# EAGLE schematic IRIS1304_v3.0 (EAGLE 7.3.0)

## Sheet 1 of 4
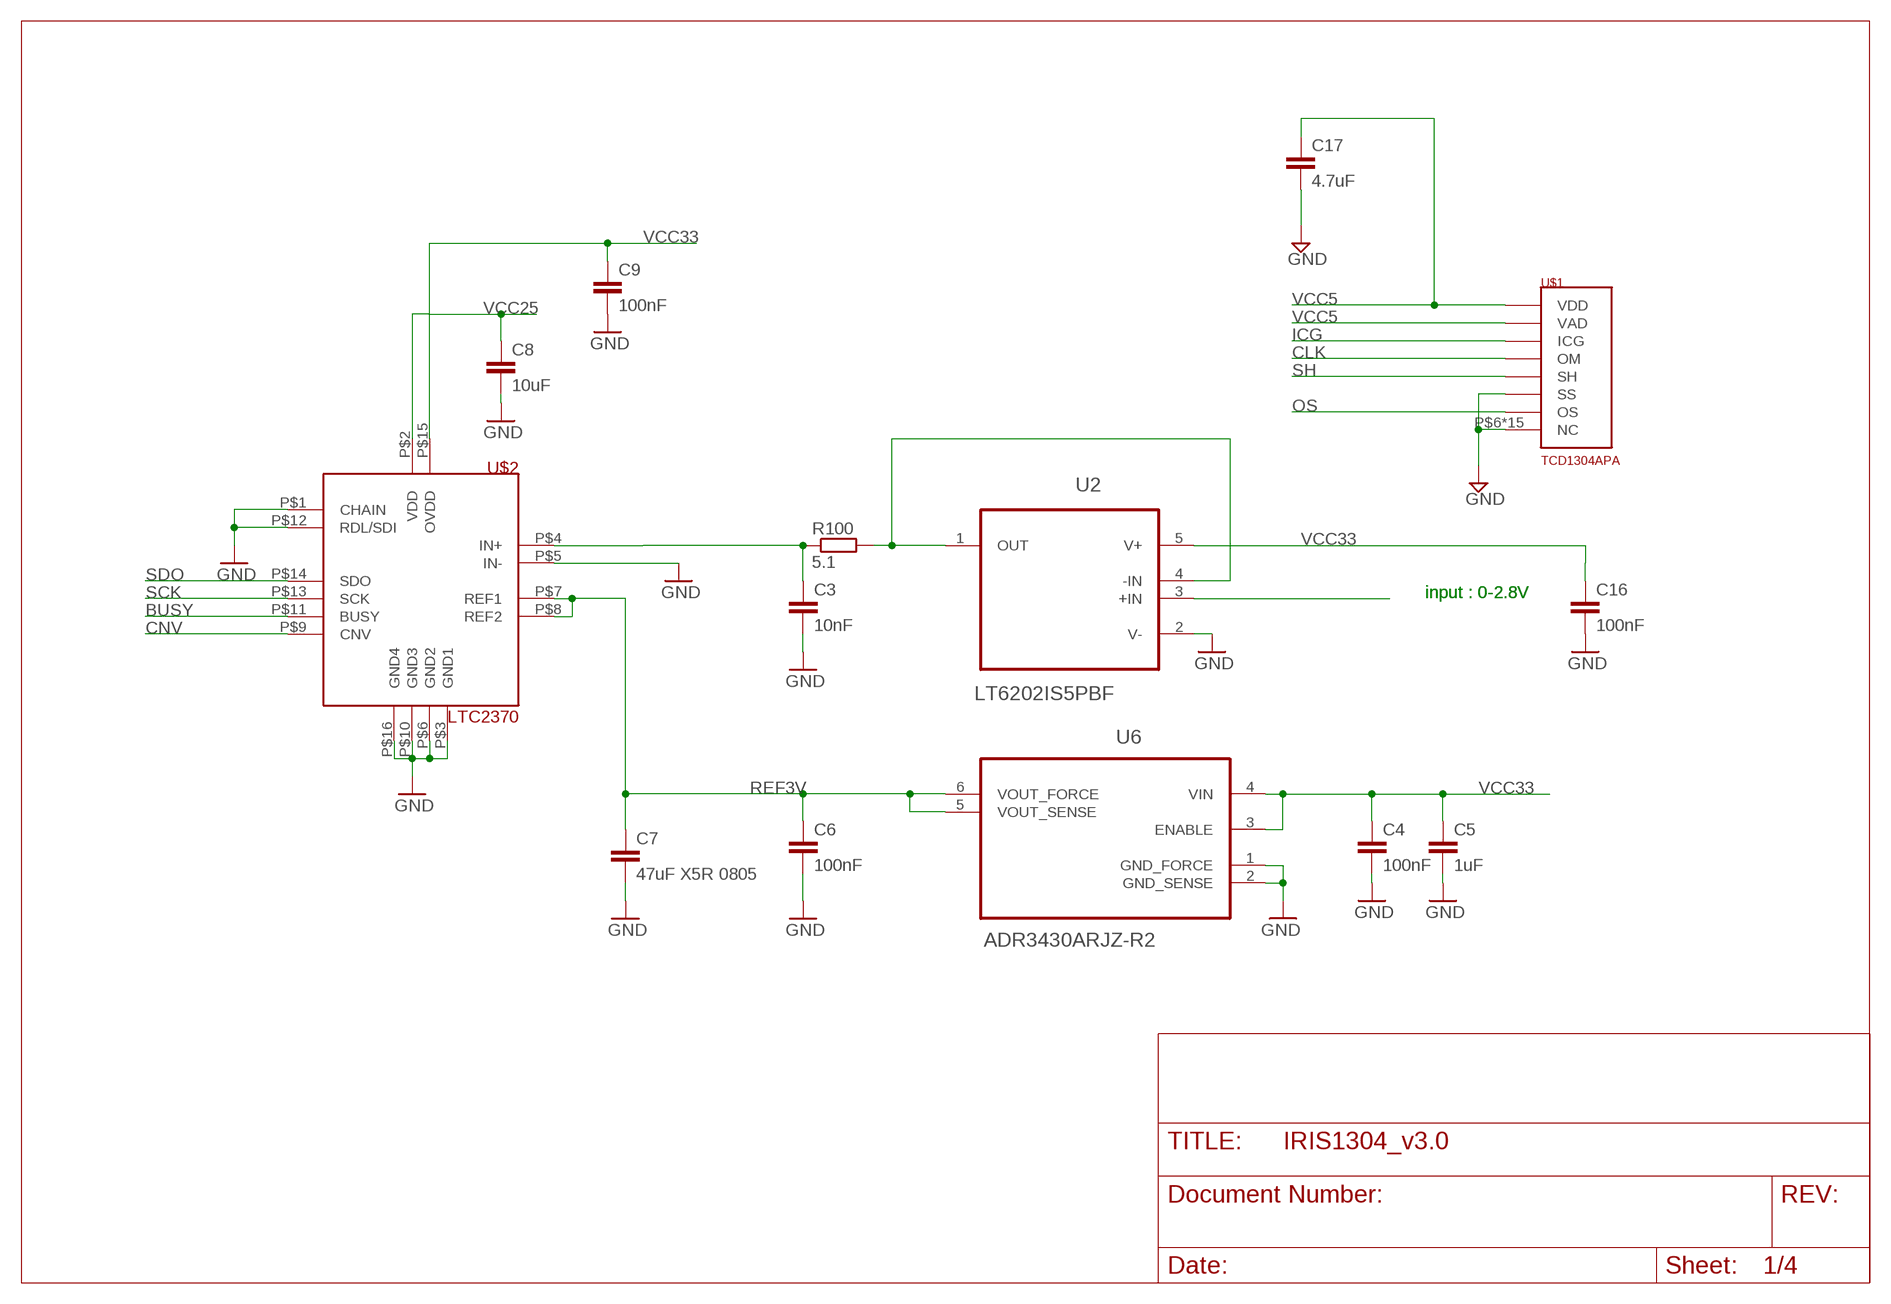
[diagram p0: schematic, sheet 1]

### Parts
C3  10nF  C-EUC0603  [C0603]
C4  100nF  C-EUC0603  [C0603]
C5  1uF  C-EUC0603  [C0603]
C6  100nF  C-EUC0603  [C0603]
C7  47uF X5R 0805  C-EUC0805  [C0805]
C8  10uF  C-EUC0603  [C0603]
C9  100nF  C-EUC0603  [C0603]
C16  100nF  C-EUC0603  [C0603]
C17  4.7uF  C-EUC0603  [C0603]
R100  5.1  R-EU_R0603  [R0603]
U2  LT6202IS5PBF  [SOT95P280X100-5N]
U6  ADR3430ARJZ-R2  [SOT95P280X145-6N]
U$1  TCD1304APA  [ILX511]
U$2  LTC2370  [MSOP-16]

### Nets
BUSY: U$2.P$11(BUSY) ; also sheet 2
CLK: U$1.P$4(OM) ; also sheet 2
CNV: U$2.P$9(CNV) ; also sheet 2
GND: C3.2 C4.2 C5.2 C6.2 C7.2 C8.2 C9.2 C16.2 C17.2 U2.2(V-) U6.1(GND_FORCE) U6.2(GND_SENSE) U$1.P$6(NC) U$1.P$7(NC) U$1.P$8(NC) U$1.P$9(NC) U$1.P$10(NC) U$1.P$11(NC) U$1.P$12(NC) U$1.P$13(NC) U$1.P$14(NC) U$1.P$15(NC) U$1.P$16(NC) U$1.P$17(NC) U$1.P$18(NC) U$1.P$19(NC) U$1.P$20(NC) U$1.P$22(SS) U$2.P$1(CHAIN) U$2.P$3(GND1) U$2.P$5(IN-) U$2.P$6(GND2) U$2.P$10(GND3) U$2.P$12(RDL/SDI) U$2.P$16(GND4) ; also sheet 2,3,4
ICG: U$1.P$3(ICG) ; also sheet 2
N$3: C3.1 R100.1 U$2.P$4(IN+)
N$11: R100.2 U2.1(OUT) U2.4(-IN)
OS: U2.3(+IN) U$1.P$21(OS)
REF3V: C6.1 C7.1 U6.5(VOUT_SENSE) U6.6(VOUT_FORCE) U$2.P$7(REF1) U$2.P$8(REF2)
SCK: U$2.P$13(SCK) ; also sheet 2
SDO: U$2.P$14(SDO) ; also sheet 2
SH: U$1.P$5(SH) ; also sheet 2
VCC5: C17.1 U$1.P$1(VDD) U$1.P$2(VAD) ; also sheet 2,3
VCC25: C8.1 U$2.P$2(VDD) ; also sheet 2
VCC33: C4.1 C5.1 C9.1 C16.1 U2.5(V+) U6.3(ENABLE) U6.4(VIN) U$2.P$15(OVDD) ; also sheet 2,3,4

### Notes on the sheet
- input : 0-2.8V | input : 0-2.8V

## Sheet 2 of 4
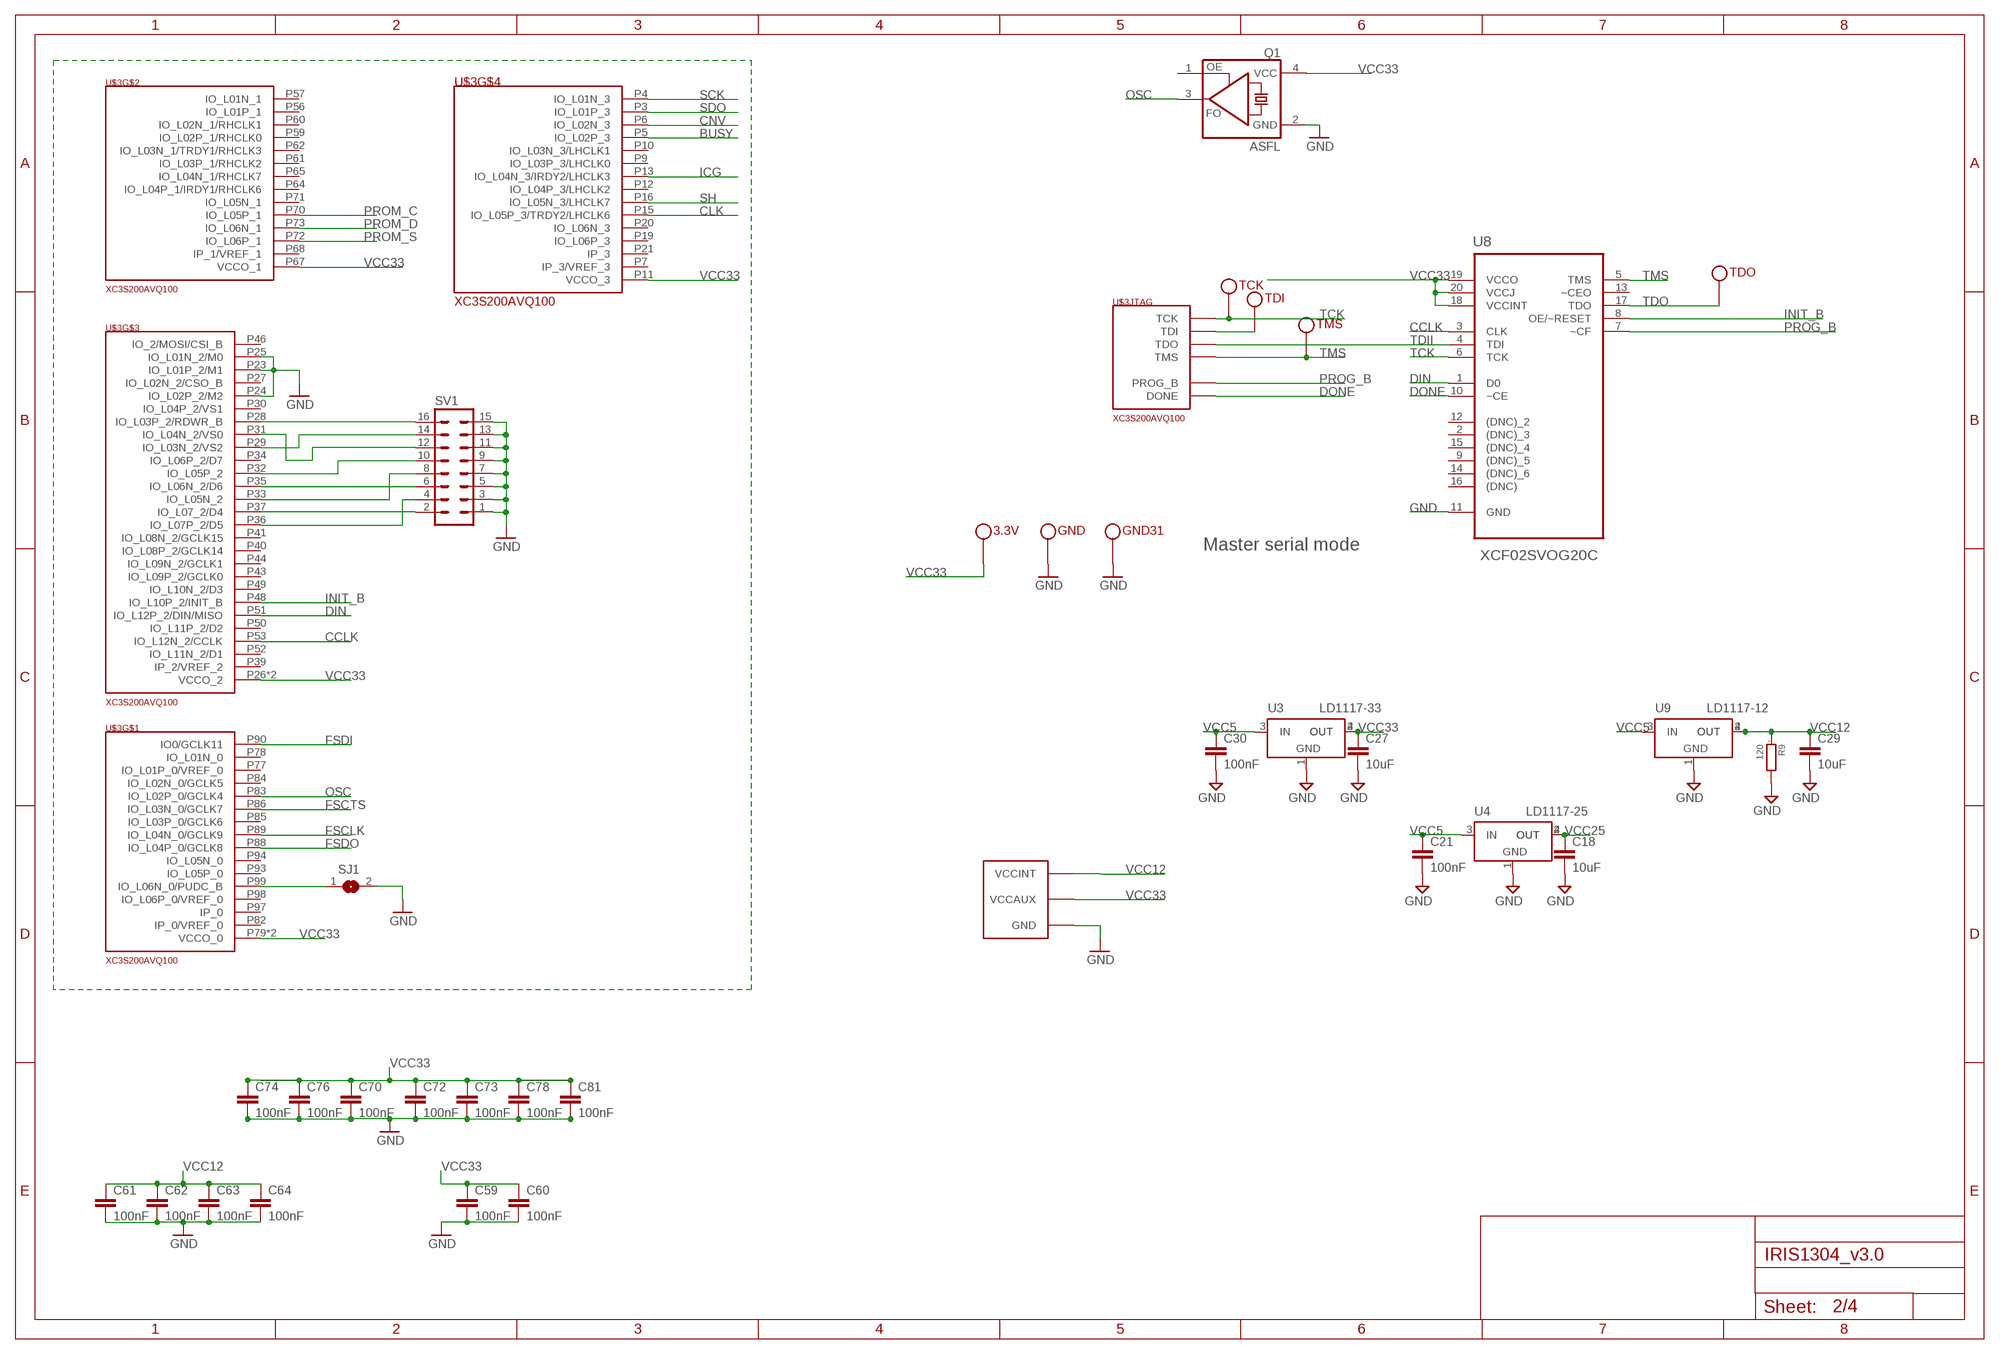
[diagram p1: schematic, sheet 2]

### Parts
3.3V  TEST  [TEST]
C18  10uF  C-EUC0603  [C0603]
C21  100nF  C-EUC0603  [C0603]
C27  10uF  C-EUC0603  [C0603]
C29  10uF  C-EUC0603  [C0603]
C30  100nF  C-EUC0603  [C0603]
C59  100nF  C-EUC0603  [C0603]
C60  100nF  C-EUC0603  [C0603]
C61  100nF  C-EUC0603  [C0603]
C62  100nF  C-EUC0603  [C0603]
C63  100nF  C-EUC0603  [C0603]
C64  100nF  C-EUC0603  [C0603]
C70  100nF  C-EUC0603  [C0603]
C72  100nF  C-EUC0603  [C0603]
C73  100nF  C-EUC0603  [C0603]
C74  100nF  C-EUC0603  [C0603]
C76  100nF  C-EUC0603  [C0603]
C78  100nF  C-EUC0603  [C0603]
C81  100nF  C-EUC0603  [C0603]
GND  TEST  [TEST]
GND31  TEST  [TEST]
Q1  ASFL  [ASF]
R9  120  R0805  [0805@1]
SJ1  SJ  [SJ]
SV1  ML16  [ML16]
TCK  TEST  [TEST]
TDI  TEST  [TEST]
TDO  TEST  [TEST]
TMS  TEST  [TEST]
U3  LD1117-33  LD1117  [SOT223]
U4  LD1117-25  LD1117  [SOT223]
U8  XCF02SVOG20C  [SOP65P640X119-20N]
U9  LD1117-12  LD1117  [SOT223]
U$3  XC3S200AVQ100  [VQ100]

### Nets
BUSY: U$3.P5(IO_L02P_3) ; also sheet 1
CCLK: U8.3(CLK) U$3.P53(IO_L12N_2/CCLK)
CLK: U$3.P15(IO_L05P_3/TRDY2/LHCLK6) ; also sheet 1
CNV: U$3.P6(IO_L02N_3) ; also sheet 1
DIN: U8.1(D0) U$3.P51(IO_L12P_2/DIN/MISO)
DONE: U8.10(~CE) U$3.P54(JTAG:DONE)
FSCLK: U$3.P89(IO_L04N_0/GCLK9) ; also sheet 3
FSCTS: U$3.P86(IO_L03N_0/GCLK7) ; also sheet 3
FSDI: U$3.P90(IO0/GCLK11) ; also sheet 3
FSDO: U$3.P88(IO_L04P_0/GCLK8) ; also sheet 3
GND: C18.2 C21.2 C27.2 C29.2 C30.2 C59.2 C60.2 C61.2 C62.2 C63.2 C64.2 C70.2 C72.2 C73.2 C74.2 C76.2 C78.2 C81.2 GND31.P$1 GND.P$1 Q1.2(GND) R9.2 SJ1.2 SV1.1 SV1.3 SV1.5 SV1.7 SV1.9 SV1.11 SV1.13 SV1.15 U3.1(GND) U4.1(GND) U8.11(GND) U9.1(GND) U$3.P8(GND) U$3.P14(GND) U$3.P18(GND) U$3.P23(IO_L01P_2/M1) U$3.P24(IO_L02P_2/M2) U$3.P25(IO_L01N_2/M0) U$3.P42(GND) U$3.P47(GND) U$3.P58(GND) U$3.P63(GND) U$3.P69(GND) U$3.P74(GND) U$3.P80(GND) U$3.P87(GND) U$3.P91(GND) U$3.P95(GND) ; also sheet 1,3,4
ICG: U$3.P13(IO_L04N_3/IRDY2/LHCLK3) ; also sheet 1
INIT_B: U8.8(OE/~RESET) U$3.P48(IO_L10P_2/INIT_B)
N$1: SJ1.1 U$3.P99(IO_L06N_0/PUDC_B)
N$2: SV1.10 U$3.P32(IO_L05P_2)
N$4: SV1.16 U$3.P28(IO_L03P_2/RDWR_B)
N$5: SV1.14 U$3.P29(IO_L03N_2/VS2)
N$6: SV1.12 U$3.P31(IO_L04N_2/VS0)
N$7: SV1.8 U$3.P33(IO_L05N_2)
N$10: SV1.6 U$3.P35(IO_L06N_2/D6)
N$14: SV1.4 U$3.P36(IO_L07P_2/D5)
N$15: SV1.2 U$3.P37(IO_L07_2/D4)
OSC: Q1.3(FO) U$3.P83(IO_L02P_0/GCLK4)
PROG_B: U8.7(~CF) U$3.P100(JTAG:PROG_B)
PROM_C: U$3.P70(IO_L05P_1) ; also sheet 4
PROM_D: U$3.P73(IO_L06N_1) ; also sheet 4
PROM_S: U$3.P72(IO_L06P_1) ; also sheet 4
SCK: U$3.P4(IO_L01N_3) ; also sheet 1
SDO: U$3.P3(IO_L01P_3) ; also sheet 1
SH: U$3.P16(IO_L05N_3/LHCLK7) ; also sheet 1
TCK: TCK.P$1 U8.6(TCK) U$3.P76(JTAG:TCK)
TDI: TDI.P$1 U$3.P2(JTAG:TDI)
TDII: U8.4(TDI) U$3.P75(JTAG:TDO)
TDO: TDO.P$1 U8.17(TDO)
TMS: TMS.P$1 U8.5(TMS) U$3.P1(JTAG:TMS)
VCC5: C21.1 C30.1 U3.3(IN) U4.3(IN) U9.3(IN) ; also sheet 1,3
VCC12: C29.1 C61.1 C62.1 C63.1 C64.1 R9.1 U9.2(OUT) U9.4(OUT) U$3.P17(VCCINT) U$3.P38(VCCINT) U$3.P66(VCCINT) U$3.P81(VCCINT)
VCC25: C18.1 U4.2(OUT) U4.4(OUT) ; also sheet 1
VCC33: 3.3V.P$1 C27.1 C59.1 C60.1 C70.1 C72.1 C73.1 C74.1 C76.1 C78.1 C81.1 Q1.4(VCC) U3.2(OUT) U3.4(OUT) U8.18(VCCINT) U8.19(VCCO) U8.20(VCCJ) U$3.P11(VCCO_3) U$3.P22(VCCAUX) U$3.P26(VCCO_2) U$3.P45(VCCO_2) U$3.P55(VCCAUX) U$3.P67(VCCO_1) U$3.P79(VCCO_0) U$3.P92(VCCAUX) U$3.P96(VCCO_0) ; also sheet 1,3,4
Unconnected: Q1.1(OE) U8.2((DNC)_3) U8.9((DNC)_5) U8.12((DNC)_2) U8.13(~CEO) U8.14((DNC)_6) U8.15((DNC)_4) U8.16((DNC)) U$3.P7(IP_3/VREF_3) U$3.P9(IO_L03P_3/LHCLK0) U$3.P10(IO_L03N_3/LHCLK1) U$3.P12(IO_L04P_3/LHCLK2) U$3.P19(IO_L06P_3) U$3.P20(IO_L06N_3) U$3.P21(IP_3) U$3.P27(IO_L02N_2/CSO_B) U$3.P30(IO_L04P_2/VS1) U$3.P34(IO_L06P_2/D7) U$3.P39(IP_2/VREF_2) U$3.P40(IO_L08P_2/GCLK14) U$3.P41(IO_L08N_2/GCLK15) U$3.P43(IO_L09P_2/GCLK0) U$3.P44(IO_L09N_2/GCLK1) U$3.P46(IO_2/MOSI/CSI_B) U$3.P49(IO_L10N_2/D3) U$3.P50(IO_L11P_2/D2) U$3.P52(IO_L11N_2/D1) U$3.P56(IO_L01P_1) U$3.P57(IO_L01N_1) U$3.P59(IO_L02P_1/RHCLK0) U$3.P60(IO_L02N_1/RHCLK1) U$3.P61(IO_L03P_1/RHCLK2) U$3.P62(IO_L03N_1/TRDY1/RHCLK3) U$3.P64(IO_L04P_1/IRDY1/RHCLK6) U$3.P65(IO_L04N_1/RHCLK7) U$3.P68(IP_1/VREF_1) U$3.P71(IO_L05N_1) U$3.P77(IO_L01P_0/VREF_0) U$3.P78(IO_L01N_0) U$3.P82(IP_0/VREF_0) U$3.P84(IO_L02N_0/GCLK5) U$3.P85(IO_L03P_0/GCLK6) U$3.P93(IO_L05P_0) U$3.P94(IO_L05N_0) U$3.P97(IP_0) U$3.P98(IO_L06P_0/VREF_0)

### Notes on the sheet
- Master serial mode

## Sheet 3 of 4
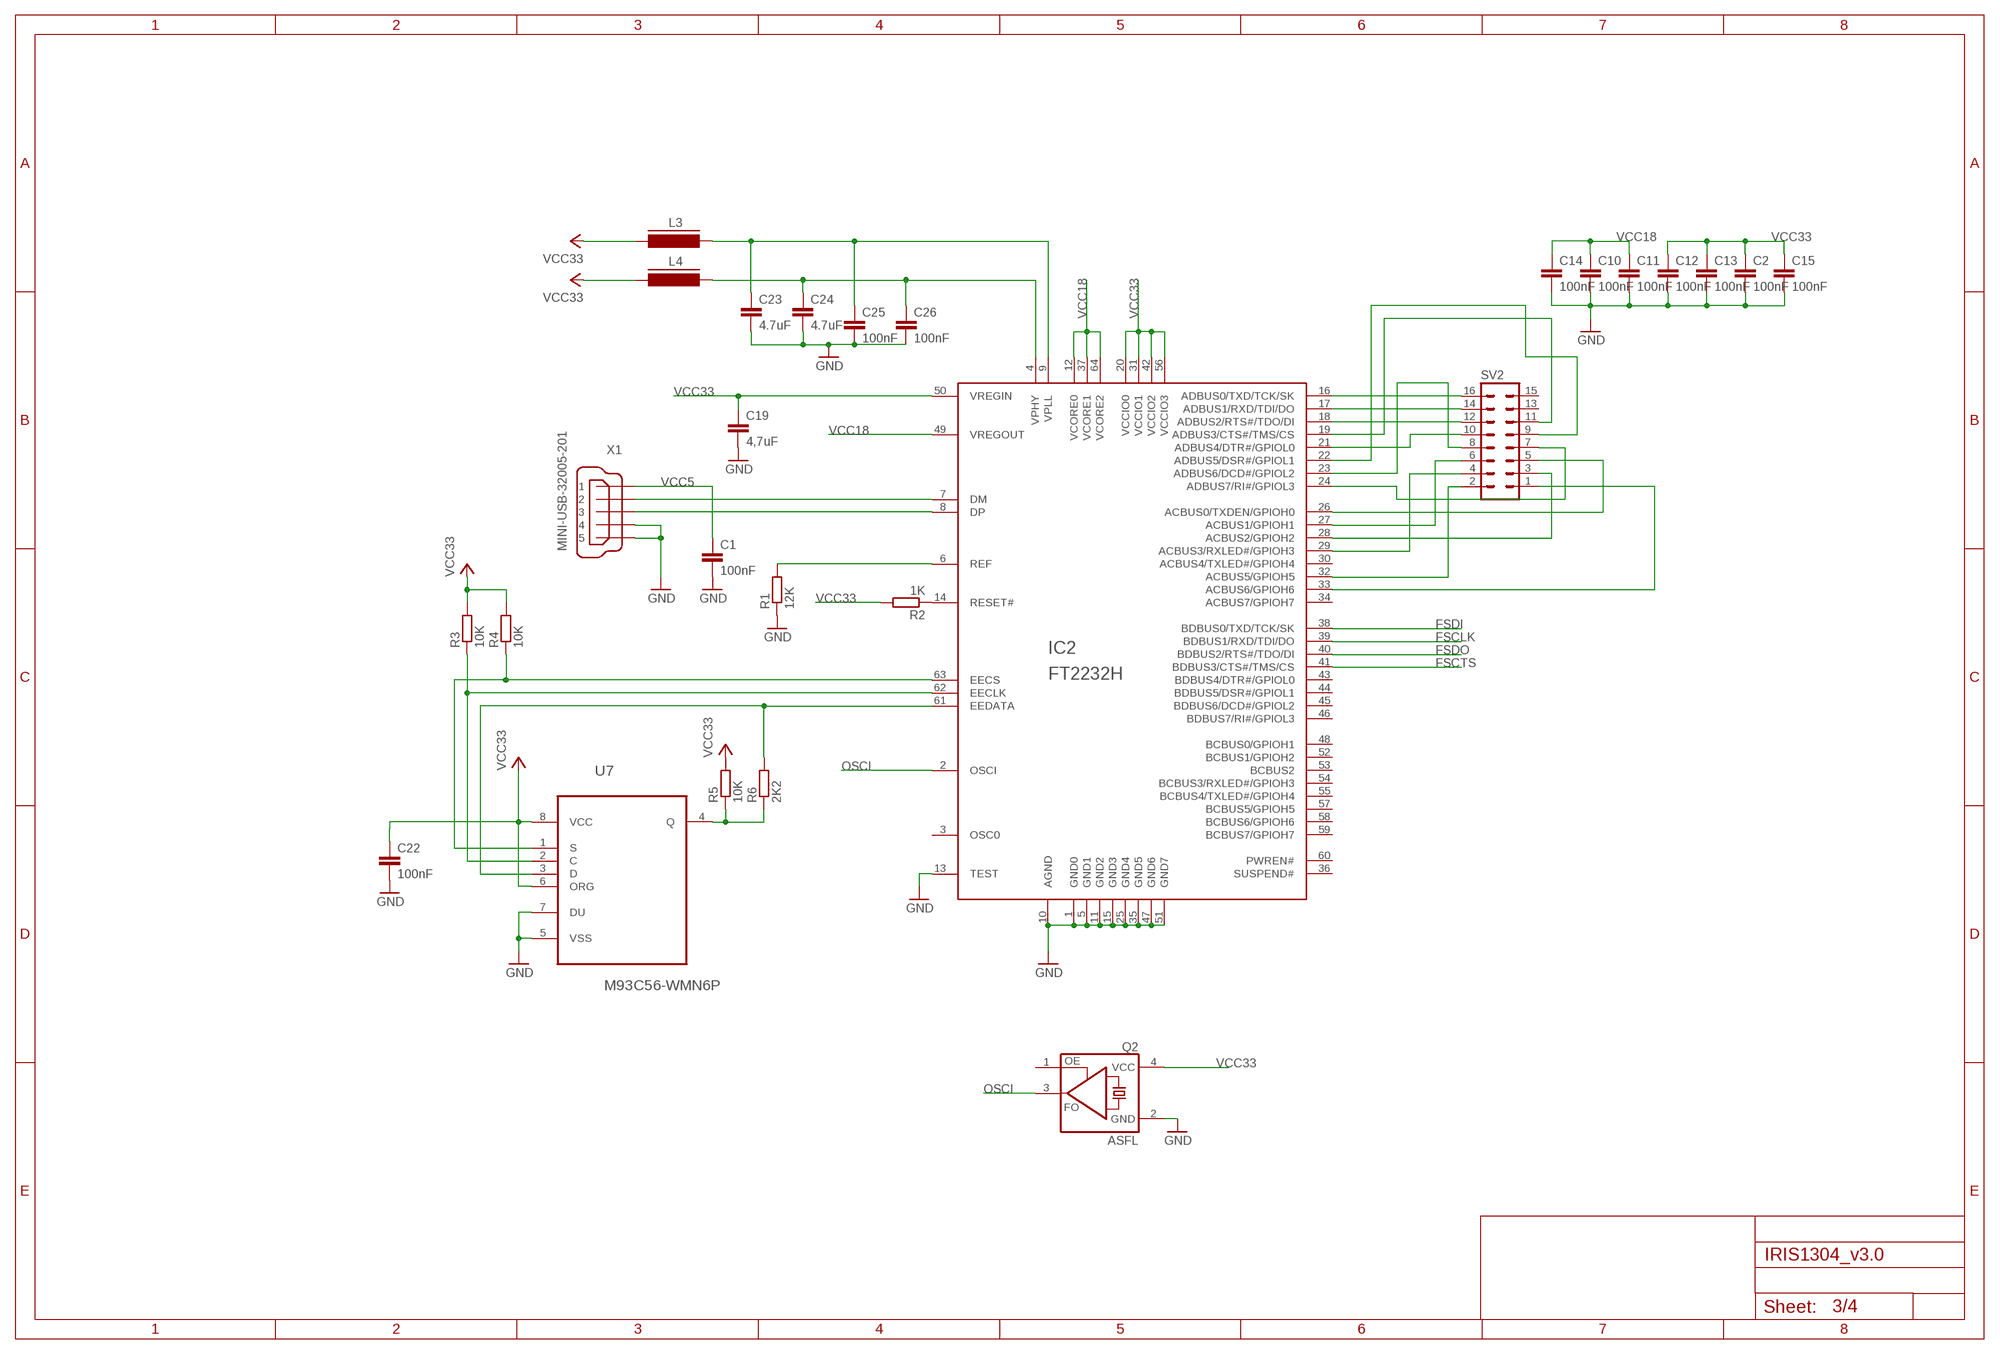
[diagram p2: schematic, sheet 3]

### Parts
C1  100nF  C-EUC0603  [C0603]
C2  100nF  C-EUC0603  [C0603]
C10  100nF  C-EUC0603  [C0603]
C11  100nF  C-EUC0603  [C0603]
C12  100nF  C-EUC0603  [C0603]
C13  100nF  C-EUC0603  [C0603]
C14  100nF  C-EUC0603  [C0603]
C15  100nF  C-EUC0603  [C0603]
C19  4,7uF  C-EUC0805  [C0805]
C22  100nF  C-EUC0603  [C0603]
C23  4.7uF  C-EUC0603  [C0603]
C24  4.7uF  C-EUC0603  [C0603]
C25  100nF  C-EUC0603  [C0603]
C26  100nF  C-EUC0603  [C0603]
IC2  FT2232H  [LQFP64]
L3  FERRITE_BEAD805  [FB805]
L4  FERRITE_BEAD805  [FB805]
Q2  ASFL  [ASF]
R1  12K  R-EU_R0603  [R0603]
R2  1K  R-EU_R0603  [R0603]
R3  10K  R-EU_R0603  [R0603]
R4  10K  R-EU_R0603  [R0603]
R5  10K  R-EU_R0603  [R0603]
R6  2K2  R-EU_R0603  [R0603]
SV2  ML16  [ML16]
U7  M93C56-WMN6P  [SOIC127P600X175-8N]
X1  MINI-USB-32005-201  [32005-201]

### Nets
D+: IC2.8(DP) X1.3
D-: IC2.7(DM) X1.2
FSCLK: IC2.39(BDBUS1/RXD/TDI/DO) ; also sheet 2
FSCTS: IC2.41(BDBUS3/CTS#/TMS/CS) ; also sheet 2
FSDI: IC2.38(BDBUS0/TXD/TCK/SK) ; also sheet 2
FSDO: IC2.40(BDBUS2/RTS#/TDO/DI) ; also sheet 2
GND: C1.2 C2.2 C10.2 C11.2 C12.2 C13.2 C14.2 C15.2 C19.2 C22.2 C23.2 C24.2 C25.2 C26.2 IC2.1(GND0) IC2.5(GND1) IC2.10(AGND) IC2.11(GND2) IC2.13(TEST) IC2.15(GND3) IC2.25(GND4) IC2.35(GND5) IC2.47(GND6) IC2.51(GND7) Q2.2(GND) R1.1 U7.5(VSS) U7.7(DU) X1.4 X1.5 ; also sheet 1,2,4
N$8: IC2.6(REF) R1.2
N$9: R5.1 R6.1 U7.4(Q)
N$12: IC2.61(EEDATA) R6.2 U7.3(D)
N$13: IC2.63(EECS) R4.1 U7.1(S)
N$16: IC2.24(ADBUS7/RI#/GPIOL3) SV2.7
N$17: IC2.62(EECLK) R3.1 U7.2(C)
N$18: C24.1 C26.1 IC2.4(VPHY) L4.1
N$19: C23.1 C25.1 IC2.9(VPLL) L3.1
N$20: IC2.14(RESET#) R2.1
N$22: IC2.23(ADBUS6/DCD#/GPIOL2) SV2.8
N$23: IC2.22(ADBUS5/DSR#/GPIOL1) SV2.9
N$24: IC2.21(ADBUS4/DTR#/GPIOL0) SV2.10
N$25: IC2.19(ADBUS3/CTS#/TMS/CS) SV2.11
N$26: IC2.18(ADBUS2/RTS#/TDO/DI) SV2.12
N$27: IC2.17(ADBUS1/RXD/TDI/DO) SV2.14
N$28: IC2.16(ADBUS0/TXD/TCK/SK) SV2.16
N$29: IC2.26(ACBUS0/TXDEN/GPIOH0) SV2.5
N$30: IC2.33(ACBUS6/GPIOH6) SV2.1
N$31: IC2.27(ACBUS1/GPIOH1) SV2.6
N$32: IC2.28(ACBUS2/GPIOH2) SV2.3
N$33: IC2.29(ACBUS3/RXLED#/GPIOH3) SV2.4
N$34: IC2.32(ACBUS5/GPIOH5) SV2.2
OSCI: IC2.2(OSCI) Q2.3(FO)
VCC5: C1.1 X1.1 ; also sheet 1,2
VCC18: C10.1 C11.1 C14.1 IC2.12(VCORE0) IC2.37(VCORE1) IC2.49(VREGOUT) IC2.64(VCORE2)
VCC33: C2.1 C12.1 C13.1 C15.1 C19.1 C22.1 IC2.20(VCCIO0) IC2.31(VCCIO1) IC2.42(VCCIO2) IC2.50(VREGIN) IC2.56(VCCIO3) L3.2 L4.2 Q2.4(VCC) R2.2 R3.2 R4.2 R5.2 U7.6(ORG) U7.8(VCC) ; also sheet 1,2,4
Unconnected: IC2.3(OSC0) IC2.30(ACBUS4/TXLED#/GPIOH4) IC2.34(ACBUS7/GPIOH7) IC2.36(SUSPEND#) IC2.43(BDBUS4/DTR#/GPIOL0) IC2.44(BDBUS5/DSR#/GPIOL1) IC2.45(BDBUS6/DCD#/GPIOL2) IC2.46(BDBUS7/RI#/GPIOL3) IC2.48(BCBUS0/GPIOH1) IC2.52(BCBUS1/GPIOH2) IC2.53(BCBUS2) IC2.54(BCBUS3/RXLED#/GPIOH3) IC2.55(BCBUS4/TXLED#/GPIOH4) IC2.57(BCBUS5/GPIOH5) IC2.58(BCBUS6/GPIOH6) IC2.59(BCBUS7/GPIOH7) IC2.60(PWREN#) Q2.1(OE) SV2.13 SV2.15

## Sheet 4 of 4
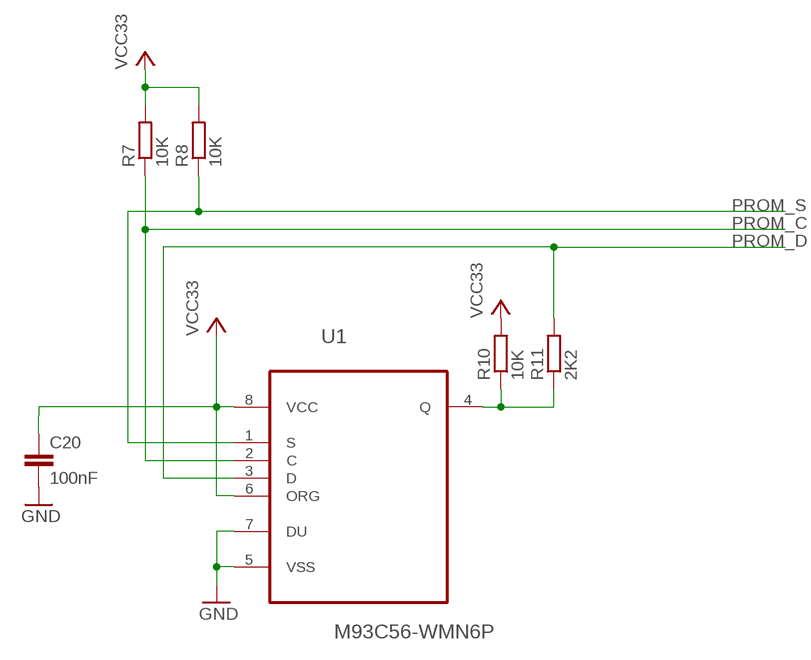
[diagram p3: schematic, sheet 4]

### Parts
C20  100nF  C-EUC0603  [C0603]
R7  10K  R-EU_R0603  [R0603]
R8  10K  R-EU_R0603  [R0603]
R10  10K  R-EU_R0603  [R0603]
R11  2K2  R-EU_R0603  [R0603]
U1  M93C56-WMN6P  [SOIC127P600X175-8N]

### Nets
GND: C20.2 U1.5(VSS) U1.7(DU) ; also sheet 1,2,3
N$35: R10.1 R11.1 U1.4(Q)
PROM_C: R7.1 U1.2(C) ; also sheet 2
PROM_D: R11.2 U1.3(D) ; also sheet 2
PROM_S: R8.1 U1.1(S) ; also sheet 2
VCC33: C20.1 R7.2 R8.2 R10.2 U1.6(ORG) U1.8(VCC) ; also sheet 1,2,3

## Library data of the parts
3.3V GND GND31 TCK TDI TDO TMS = IRIS lib v1.0:TEST; MF: ITT CANNON; MPN: 001-1007-040FB9; OC_FARNELL: 1347797
C1 C2 C4 C6 C9-C16 C20-C22 C25 C26 C30 C59-C64 C70 C72-C74 C76 C78 C81 = rcl:C-EU: CAPACITOR, European symbol; MF: AVX; MPN: 06033G104ZAT2A; OC_FARNELL: 317287
C3 = rcl:C-EU: CAPACITOR, European symbol; MF: AVX; MPN: 06035G103ZAT2A; OC_FARNELL: 317433
C5 = rcl:C-EU: CAPACITOR, European symbol; MF: KEMET; MPN: C0603C105K3PACTU; OC_FARNELL: 1288202
C7 = rcl:C-EU: CAPACITOR, European symbol; MF: KEMET; MPN: C0805C476M9PACTU; OC_FARNELL: 1572633
C8 C18 C27 C29 = rcl:C-EU: CAPACITOR, European symbol; MF: KEMET; MPN: C0603C106M9PACTU; OC_FARNELL: 1288201
C17 C23 C24 = rcl:C-EU: CAPACITOR, European symbol; MF: YAGEO (PHYCOMP); MPN: CC0603KRX5R6BB475; OC_FARNELL: 1458898
C19 = rcl:C-EU: CAPACITOR, European symbol; MF: AVX; MPN: 0805ZD335KAT2A; OC_FARNELL: 1301817
IC2 = DP-EagleLibrary:FT2232H: DUAL HIGH SPEED USB TO MULTIPURPOSE UART/FIFO IC; MF: FTDI; MPN: FT2232HL-R; OC_FARNELL: 1697461
L3 L4 = dp_devices:FERRITE_BEAD; OC_FARNELL: unknown
Q1 Q2 = crystal:ASF*: CRYSTAL CLOCK OSCILLATORS 5.0 Vdc or 3.3 Vdc - LOW PROFILE ULTRA MINIATURE CERAMIC SURFACE MOUNT Source: http://www.abracon.com/Oscillators/asf1-L-L1.pdf; MF: ABRACON; MPN: ASFL1-12.000MHZ-EK-T; OC_FARNELL: 7943088; OC_NEWARK: 99M0411
R1 = rcl:R-EU_: RESISTOR, European symbol; MF: TE CONNECTIVITY; MPN: CPF0201D12K1C1; OC_FARNELL: 2117895
R2 = rcl:R-EU_: RESISTOR, European symbol; MF: VISHAY DRALORIC; MPN: CRCW06031K00FKEA; OC_FARNELL: 1469740
R3-R5 R7 R8 R10 = rcl:R-EU_: RESISTOR, European symbol; MF: TE CONNECTIVITY / NEOHM; MPN: CPF0603F10KC1; OC_FARNELL: 1527581
R6 R11 = rcl:R-EU_: RESISTOR, European symbol; MF: PANASONIC ELECTRONIC COMPONENTS; MPN: ERJP03F2201V; OC_FARNELL: 1750676
R9 = Bogdan_Commons:R: RESISTOR, European symbol; MF: TE CONNECTIVITY / SIGMA INDUCTORS; MPN: BMB2A0120AN1; OC_FARNELL: 1193413
R100 = rcl:R-EU_: RESISTOR, European symbol; MF: VISHAY DALE; MPN: CRCW06035R10FNEA; OC_FARNELL: 1563921
SJ1 = jumper:SJ: SMD solder JUMPER; OC_FARNELL: unknown
SV1 SV2 = con-harting-ml:ML16: HARTING; OC_FARNELL: unknown; OC_NEWARK: unknown
U1 U7 = IRIS:M93C56-WMN6P: MICROWIRE serial access EEPROM; MF: STMICROELECTRONICS; MPN: M93C56-WMN6P; OC_FARNELL: 9882448; OC_NEWARK: 26M1829; PACKAGE: SOIC-8; SUPPLIER: STMICROELECTRONICS
U2 = SpectroLib:LT6202IS5PBF: Low Power Op Amps; MF: LINEAR TECHNOLOGY; MPN: LT6202IS5#PBF; OC_FARNELL: 2102627; OC_NEWARK: 84R3670; PACKAGE: TSOT-23-5; SUPPLIER: Linear Technology
U3 = GadgetFactory:LD1117; MF: LINEAR TECHNOLOGY; MPN: LT1117CST-3.3#PBF; OC_FARNELL: 1663356
U4 = GadgetFactory:LD1117; MF: STMICROELECTRONICS; MPN: LD1117S25TR; OC_FARNELL: 1132000
U6 = SpectroLib:ADR3430ARJZ-R2: Voltage References; MF: ANALOG DEVICES; MPN: ADR3430ARJZ-R2; OC_FARNELL: 1899425; OC_NEWARK: 76R7580; PACKAGE: SOT23-6; SUPPLIER: Analog Devices
U8 = QUBIC:XCF02SVOG20C: Platform Flash In-System Programmable Configuration PROMS; DESCRIPTION: Platform Flash In-System Programmable Configuration PROMS; MF: XILINX; MPN: XCF02SVOG20C; OC_FARNELL: 1876178; OC_NEWARK: 40T2691; PACKAGE: TSSOP-20; SUPPLIER: XILINX
U9 = GadgetFactory:LD1117; MF: LINEAR TECHNOLOGY; MPN: LT1117IST#PBF; OC_FARNELL: 2295197
U$1 = SpectroLib:TCD1304AP; OC_FARNELL: unknown
U$2 = SpectroLib:LTC2370; MF: LINEAR TECHNOLOGY; MPN: LTC2370CMS-16; OC_FARNELL: 2068071
U$3 = IRIS lib v1.0:XC3S200AVQ100; MF: XILINX; MPN: XC3S200A-4VQG100C; OC_FARNELL: 1876204
X1 = con-cypressindustries:MINI-USB-: MINI USB-B Conector Source: www.cypressindustries.com; MF: WURTH ELEKTRONIK; MPN: 65100516121; OC_FARNELL: 1642036; OC_NEWARK: unknown

## Net classes
0 default: width 0.178 mm, drill 0.381 mm, clearance 0.178 mm